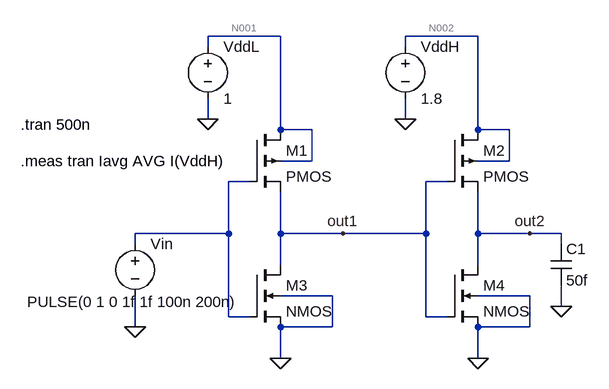
[diagram p0: schematic NoLC.asc]
NoLC.asc, the LTspice schematic file:
Version 4.1
SHEET 1 1136 680
WIRE 320 16 208 16
WIRE 624 16 512 16
WIRE 208 32 208 16
WIRE 512 32 512 16
WIRE 208 144 208 112
WIRE 512 144 512 112
WIRE 320 160 320 16
WIRE 368 160 320 160
WIRE 624 160 624 16
WIRE 672 160 624 160
WIRE 368 208 368 160
WIRE 368 208 320 208
WIRE 672 208 672 160
WIRE 672 208 624 208
WIRE 272 240 240 240
WIRE 576 240 544 240
WIRE 240 320 240 240
WIRE 240 320 96 320
WIRE 320 320 320 256
WIRE 416 320 320 320
WIRE 544 320 544 240
WIRE 544 320 416 320
WIRE 624 320 624 256
WIRE 704 320 624 320
WIRE 752 320 704 320
WIRE 96 336 96 320
WIRE 752 336 752 320
WIRE 320 368 320 320
WIRE 624 368 624 320
WIRE 400 416 320 416
WIRE 704 416 624 416
WIRE 752 432 752 400
WIRE 240 448 240 320
WIRE 272 448 240 448
WIRE 544 448 544 320
WIRE 576 448 544 448
WIRE 96 464 96 416
WIRE 400 464 400 416
WIRE 400 464 320 464
WIRE 704 464 704 416
WIRE 704 464 624 464
WIRE 320 512 320 464
WIRE 624 512 624 464
FLAG 208 144 0
FLAG 512 144 0
FLAG 320 512 0
FLAG 624 512 0
FLAG 96 464 0
FLAG 416 320 out1
FLAG 704 320 out2
FLAG 752 432 0
SYMBOL voltage 208 16 R0
WINDOW 123 0 0 Left 0
WINDOW 39 0 0 Left 0
SYMATTR InstName VddL
SYMATTR Value 1
SYMBOL voltage 512 16 R0
WINDOW 123 0 0 Left 0
WINDOW 39 0 0 Left 0
SYMATTR InstName VddH
SYMATTR Value 1.8
SYMBOL voltage 96 320 R0
WINDOW 3 -166 105 Left 2
WINDOW 123 0 0 Left 0
WINDOW 39 0 0 Left 0
SYMATTR Value PULSE(0 1 0 1f 1f 100n 200n)
SYMATTR InstName Vin
SYMBOL cap 736 336 R0
SYMATTR InstName C1
SYMATTR Value 50f
SYMBOL pmos4 272 160 R0
SYMATTR InstName M1
SYMATTR Value2 l=180n w=2u
SYMBOL pmos4 576 160 R0
SYMATTR InstName M2
SYMATTR Value2 l=180n w=2u
SYMBOL nmos4 272 368 R0
SYMATTR InstName M3
SYMBOL nmos4 576 368 R0
SYMATTR InstName M4
SYMATTR Value2 l=180n w=1u
TEXT -80 152 Left 2 !.tran 500n
TEXT -80 208 Left 2 !.meas tran Iavg AVG I(VddH)

The netlist it stands for:
* NoLC.asc
VddL N001 0 1
VddH N002 0 1.8
Vin N003 0 PULSE(0 1 0 1f 1f 100n 200n)
C1 out2 0 50f
M1 N001 N003 out1 N001 PMOS l=180n w=2u
M2 N002 out1 out2 N002 PMOS l=180n w=2u
M3 out1 N003 0 0 NMOS
M4 out2 out1 0 0 NMOS l=180n w=1u
.model NMOS NMOS
.model PMOS PMOS
.lib standard.mos
.tran 500n
.meas tran Iavg AVG I(VddH)
.backanno
.end

* Results of the author's LTspice run, read from the files saved beside the schematic
* Operating Point, zero values left out:
*   V(n001) = 1 V
*   V(n002) = 1.8 V
*   V(out1) = 1 V
*   V(out2) = 1.374 V
*   I(VddH) = -55.56 µA
*   I(VddL) = -2.01 pA
*   Ib(M3) = -1.01 pA
*   Ib(M4) = -1.384 pA
*   Id(M1) = 2.01 pA
*   Id(M2) = 55.56 µA
*   Id(M3) = 2.01 pA
*   Id(M4) = 55.56 µA
*   Is(M1) = -2.01 pA
*   Is(M2) = -55.56 µA
*   Is(M4) = -55.56 µA
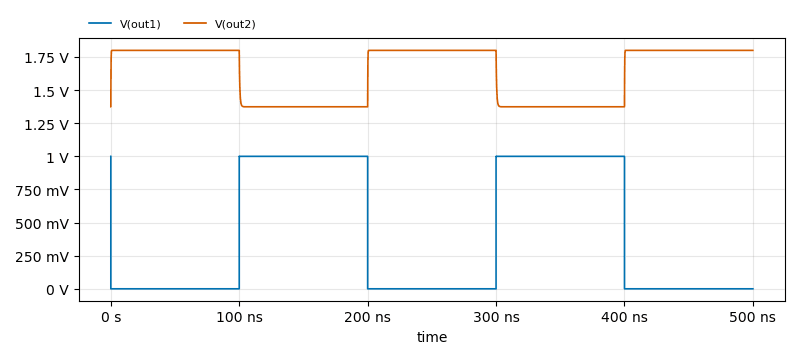
[diagram p1: Transient Analysis of NoLC.asc, plotted from the saved traces]
* Transient Analysis, 1 run:
*   V(out1): min 0 V, max 1 V, average 400 mV, rms 632.5 mV, last 100.5 nV
*   V(out2): min 1.374 V, max 1.8 V, average 1.63 V, rms 1.643 V, last 1.8 V
* From the log:
*   iavg: AVG(I(VddH))=-2.2264424146e-05 FROM 0 TO 5e-07